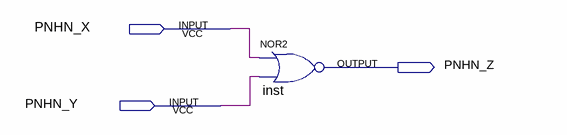
[diagram p0: schematic sheet]
// Quartus schematic Assignment4.bdf as structural Verilog: 1 symbols, 3 pins
module Assignment4 (
  input  PNHN_X,
  input  PNHN_Y,
  output PNHN_Z
);

  nor inst (PNHN_Z, PNHN_X, PNHN_Y);
endmodule
